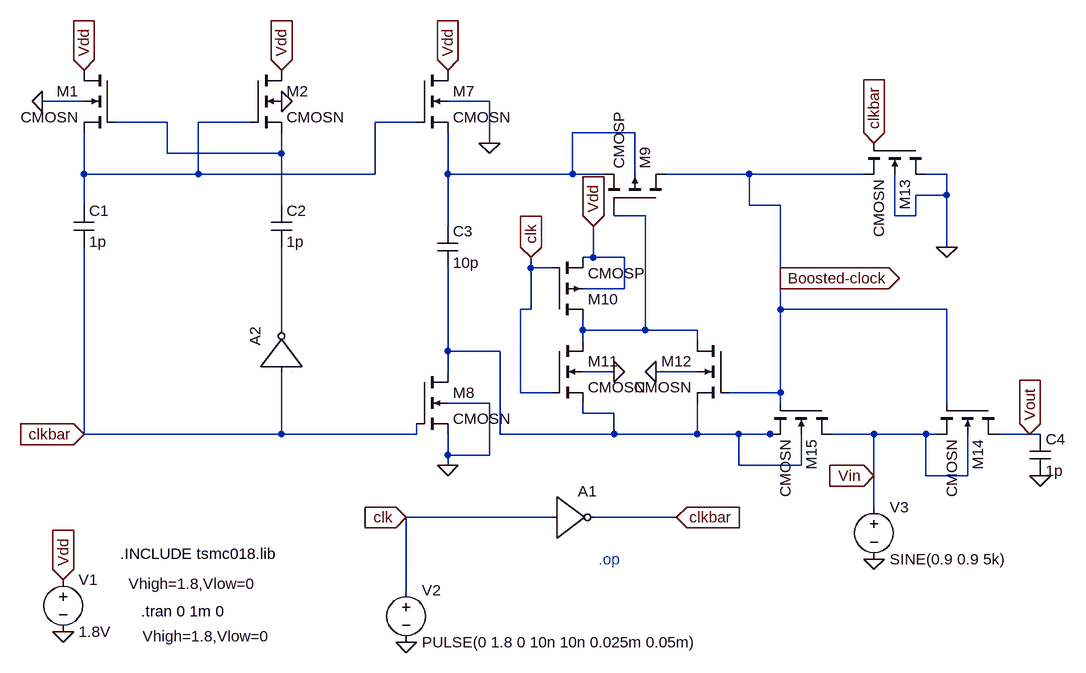
[diagram p0: schematic Nakagome Charge pump.asc]
Nakagome Charge pump.asc, the LTspice schematic file:
Version 4.1
SHEET 1 1048 1300
WIRE -512 64 -576 64
WIRE 112 64 48 64
WIRE -384 96 -464 96
WIRE -256 96 -336 96
WIRE 0 96 -64 96
WIRE 336 112 240 112
WIRE 112 128 112 64
WIRE -384 144 -384 96
WIRE -208 144 -208 112
WIRE -208 144 -384 144
WIRE -512 176 -512 112
WIRE -336 176 -336 96
WIRE -336 176 -512 176
WIRE -64 176 -64 96
WIRE -64 176 -336 176
WIRE 48 176 48 112
WIRE 240 176 240 112
WIRE 240 176 48 176
WIRE 288 176 240 176
WIRE 336 176 336 112
WIRE 512 176 384 176
WIRE 688 176 512 176
WIRE 816 176 784 176
WIRE 816 208 816 176
WIRE 816 208 768 208
WIRE -512 224 -512 176
WIRE -208 224 -208 144
WIRE 512 224 512 176
WIRE 560 224 512 224
WIRE 304 240 304 224
WIRE 352 240 304 240
WIRE 736 240 736 176
WIRE 768 240 768 208
WIRE 768 240 736 240
WIRE 48 256 48 176
WIRE 816 288 816 208
WIRE 272 304 272 256
WIRE 272 304 256 304
WIRE 320 304 272 304
WIRE 176 320 176 304
WIRE 208 320 176 320
WIRE 560 336 560 224
WIRE 320 352 320 304
WIRE 320 352 256 352
WIRE 176 384 176 320
WIRE 176 384 160 384
WIRE 560 384 560 336
WIRE 816 384 560 384
WIRE -208 416 -208 288
WIRE 256 416 256 400
WIRE 352 416 352 240
WIRE 352 416 256 416
WIRE 432 416 352 416
WIRE 256 432 256 416
WIRE 432 432 432 416
WIRE 48 448 48 320
WIRE 128 448 48 448
WIRE 48 480 48 448
WIRE 304 480 256 480
WIRE 432 480 368 480
WIRE 160 512 160 384
WIRE 208 512 160 512
WIRE 560 512 560 384
WIRE 560 512 480 512
WIRE 112 528 48 528
WIRE 560 528 560 512
WIRE 816 528 816 384
WIRE 256 544 256 528
WIRE 304 544 256 544
WIRE -512 576 -512 288
WIRE -208 576 -208 480
WIRE -208 576 -512 576
WIRE 0 576 0 560
WIRE 0 576 -208 576
WIRE 128 576 128 448
WIRE 304 576 304 544
WIRE 304 576 128 576
WIRE 432 576 432 528
WIRE 432 576 304 576
WIRE 496 576 432 576
WIRE 544 576 496 576
WIRE 560 576 544 576
WIRE 704 576 640 576
WIRE 784 576 704 576
WIRE 800 576 784 576
WIRE 944 576 896 576
WIRE 960 576 944 576
WIRE 48 608 48 576
WIRE 112 608 112 528
WIRE 112 608 48 608
WIRE 48 624 48 608
WIRE 496 624 496 576
WIRE 592 624 592 576
WIRE 592 624 496 624
WIRE 704 640 704 576
WIRE 784 640 784 576
WIRE 848 640 848 576
WIRE 848 640 784 640
WIRE 704 688 704 640
WIRE 208 704 -16 704
WIRE 400 704 272 704
WIRE -16 816 -16 704
FLAG -544 880 0
FLAG -544 800 Vdd
IOPIN -544 800 In
FLAG -512 16 Vdd
IOPIN -512 16 In
FLAG -208 16 Vdd
IOPIN -208 16 In
FLAG -16 896 0
FLAG -16 704 clk
IOPIN -16 704 In
FLAG 400 704 clkbar
IOPIN 400 704 In
FLAG -512 576 clkbar
IOPIN -512 576 In
FLAG 48 624 0
FLAG 48 16 Vdd
IOPIN 48 16 In
FLAG -576 64 0
FLAG -208 64 0
FLAG 704 768 0
FLAG 960 640 0
FLAG 272 256 Vdd
IOPIN 272 256 In
FLAG 176 304 clk
IOPIN 176 304 In
FLAG 112 128 0
FLAG 304 480 0
FLAG 368 480 0
FLAG 704 128 clkbar
IOPIN 704 128 In
FLAG 816 288 0
FLAG 560 336 Boosted-clock
IOPIN 560 336 Out
FLAG 704 640 Vin
IOPIN 704 640 In
FLAG 944 576 Vout
IOPIN 944 576 In
SYMBOL cmosn -464 16 M0
SYMATTR InstName M1
SYMATTR Value2 l=0.18u w=0.05u
SYMBOL cmosn -256 16 R0
SYMATTR InstName M2
SYMATTR Value2 l=0.18u w=0.05u
SYMBOL cap -224 224 R0
SYMATTR InstName C2
SYMATTR Value 1p
SYMBOL voltage -544 784 R0
WINDOW 123 0 0 Left 0
WINDOW 39 0 0 Left 0
SYMATTR InstName V1
SYMATTR Value 1.8V
SYMBOL cap -528 224 R0
SYMATTR InstName C1
SYMATTR Value 1p
SYMBOL voltage -16 800 R0
WINDOW 123 0 0 Left 0
WINDOW 39 0 0 Left 0
SYMATTR InstName V2
SYMATTR Value PULSE(0 1.8 0 10n 10n 0.025m 0.05m)
SYMBOL cmosn 0 16 R0
SYMATTR InstName M7
SYMATTR Value2 l=0.18u w=0.2u
SYMBOL cmosn 0 480 R0
SYMATTR InstName M8
SYMATTR Value2 l=0.18u w=200u
SYMBOL cap 32 256 R0
SYMATTR InstName C3
SYMATTR Value 10p
SYMBOL cmosp 384 224 M270
SYMATTR InstName M9
SYMATTR Value2 l=0.18u w=100u
SYMBOL cmosp 208 400 M180
SYMATTR InstName M10
SYMATTR Value2 l=0.18u w=30u
SYMBOL cmosn 208 432 R0
SYMATTR InstName M11
SYMATTR Value2 l=0.18u w=10u
SYMBOL cmosn 480 432 M0
SYMATTR InstName M12
SYMATTR Value2 l=0.18u w=10u
SYMBOL cmosn 896 528 R90
SYMATTR InstName M14
SYMATTR Value2 l=0.18u w=0.2u
SYMBOL voltage 704 672 R0
WINDOW 123 24 124 Left 2
WINDOW 39 0 0 Left 0
SYMATTR InstName V3
SYMATTR Value SINE(0.9 0.9 5k)
SYMBOL cap 944 576 R0
SYMATTR InstName C4
SYMATTR Value 1p
SYMBOL cmosn 640 528 R90
SYMATTR InstName M15
SYMATTR Value2 l=0.18u w=100u
SYMBOL cmosn 784 128 R90
SYMATTR InstName M13
SYMATTR Value2 l=0.18u w=1u
SYMBOL Digital\\inv 208 640 R0
WINDOW 3 -630 247 Left 2
SYMATTR InstName A1
SYMATTR Value Vhigh=1.8,Vlow=0
SYMBOL Digital\\inv -272 480 R270
WINDOW 3 -326 -171 VRight 2
SYMATTR InstName A2
SYMATTR Value Vhigh=1.8,Vlow=0
TEXT -456 760 Left 2 !.INCLUDE tsmc018.lib
TEXT -424 848 Left 2 !.tran 0 1m 0
TEXT 280 768 Left 2 ;.op

The netlist it stands for:
* Nakagome Charge pump.asc
M1 Vdd N001 N002 0 CMOSN l=0.18u w=0.05u
M2 Vdd N002 N001 0 CMOSN l=0.18u w=0.05u
C2 N001 N005 1p
V1 Vdd 0 1.8V
C1 N002 clkbar 1p
V2 clk 0 PULSE(0 1.8 0 10n 10n 0.025m 0.05m)
M7 Vdd N002 N003 0 CMOSN l=0.18u w=0.2u
M8 N006 clkbar 0 0 CMOSN l=0.18u w=200u
C3 N003 N006 10p
M9 Boosted-clock N004 N003 N003 CMOSP l=0.18u w=100u
M10 N004 clk Vdd Vdd CMOSP l=0.18u w=30u
M11 N004 clk N006 0 CMOSN l=0.18u w=10u
M12 N004 Boosted-clock N006 0 CMOSN l=0.18u w=10u
M14 Vout Boosted-clock Vin Vin CMOSN l=0.18u w=0.2u
V3 Vin 0 SINE(0.9 0.9 5k)
C4 Vout 0 1p
M15 Vin Boosted-clock N006 N006 CMOSN l=0.18u w=100u
M13 0 clkbar Boosted-clock 0 CMOSN l=0.18u w=1u
A1 clk 0 0 0 0 clkbar 0 0 BUF Vhigh=1.8,Vlow=0
A2 clkbar 0 0 0 0 N005 0 0 BUF Vhigh=1.8,Vlow=0
.model NMOS NMOS
.model PMOS PMOS
.lib standard.mos
.INCLUDE tsmc018.lib
.tran 0 1m 0
* .op
.backanno
.end